# EAGLE schematic 8bit_ALU (EAGLE 9.4.1)
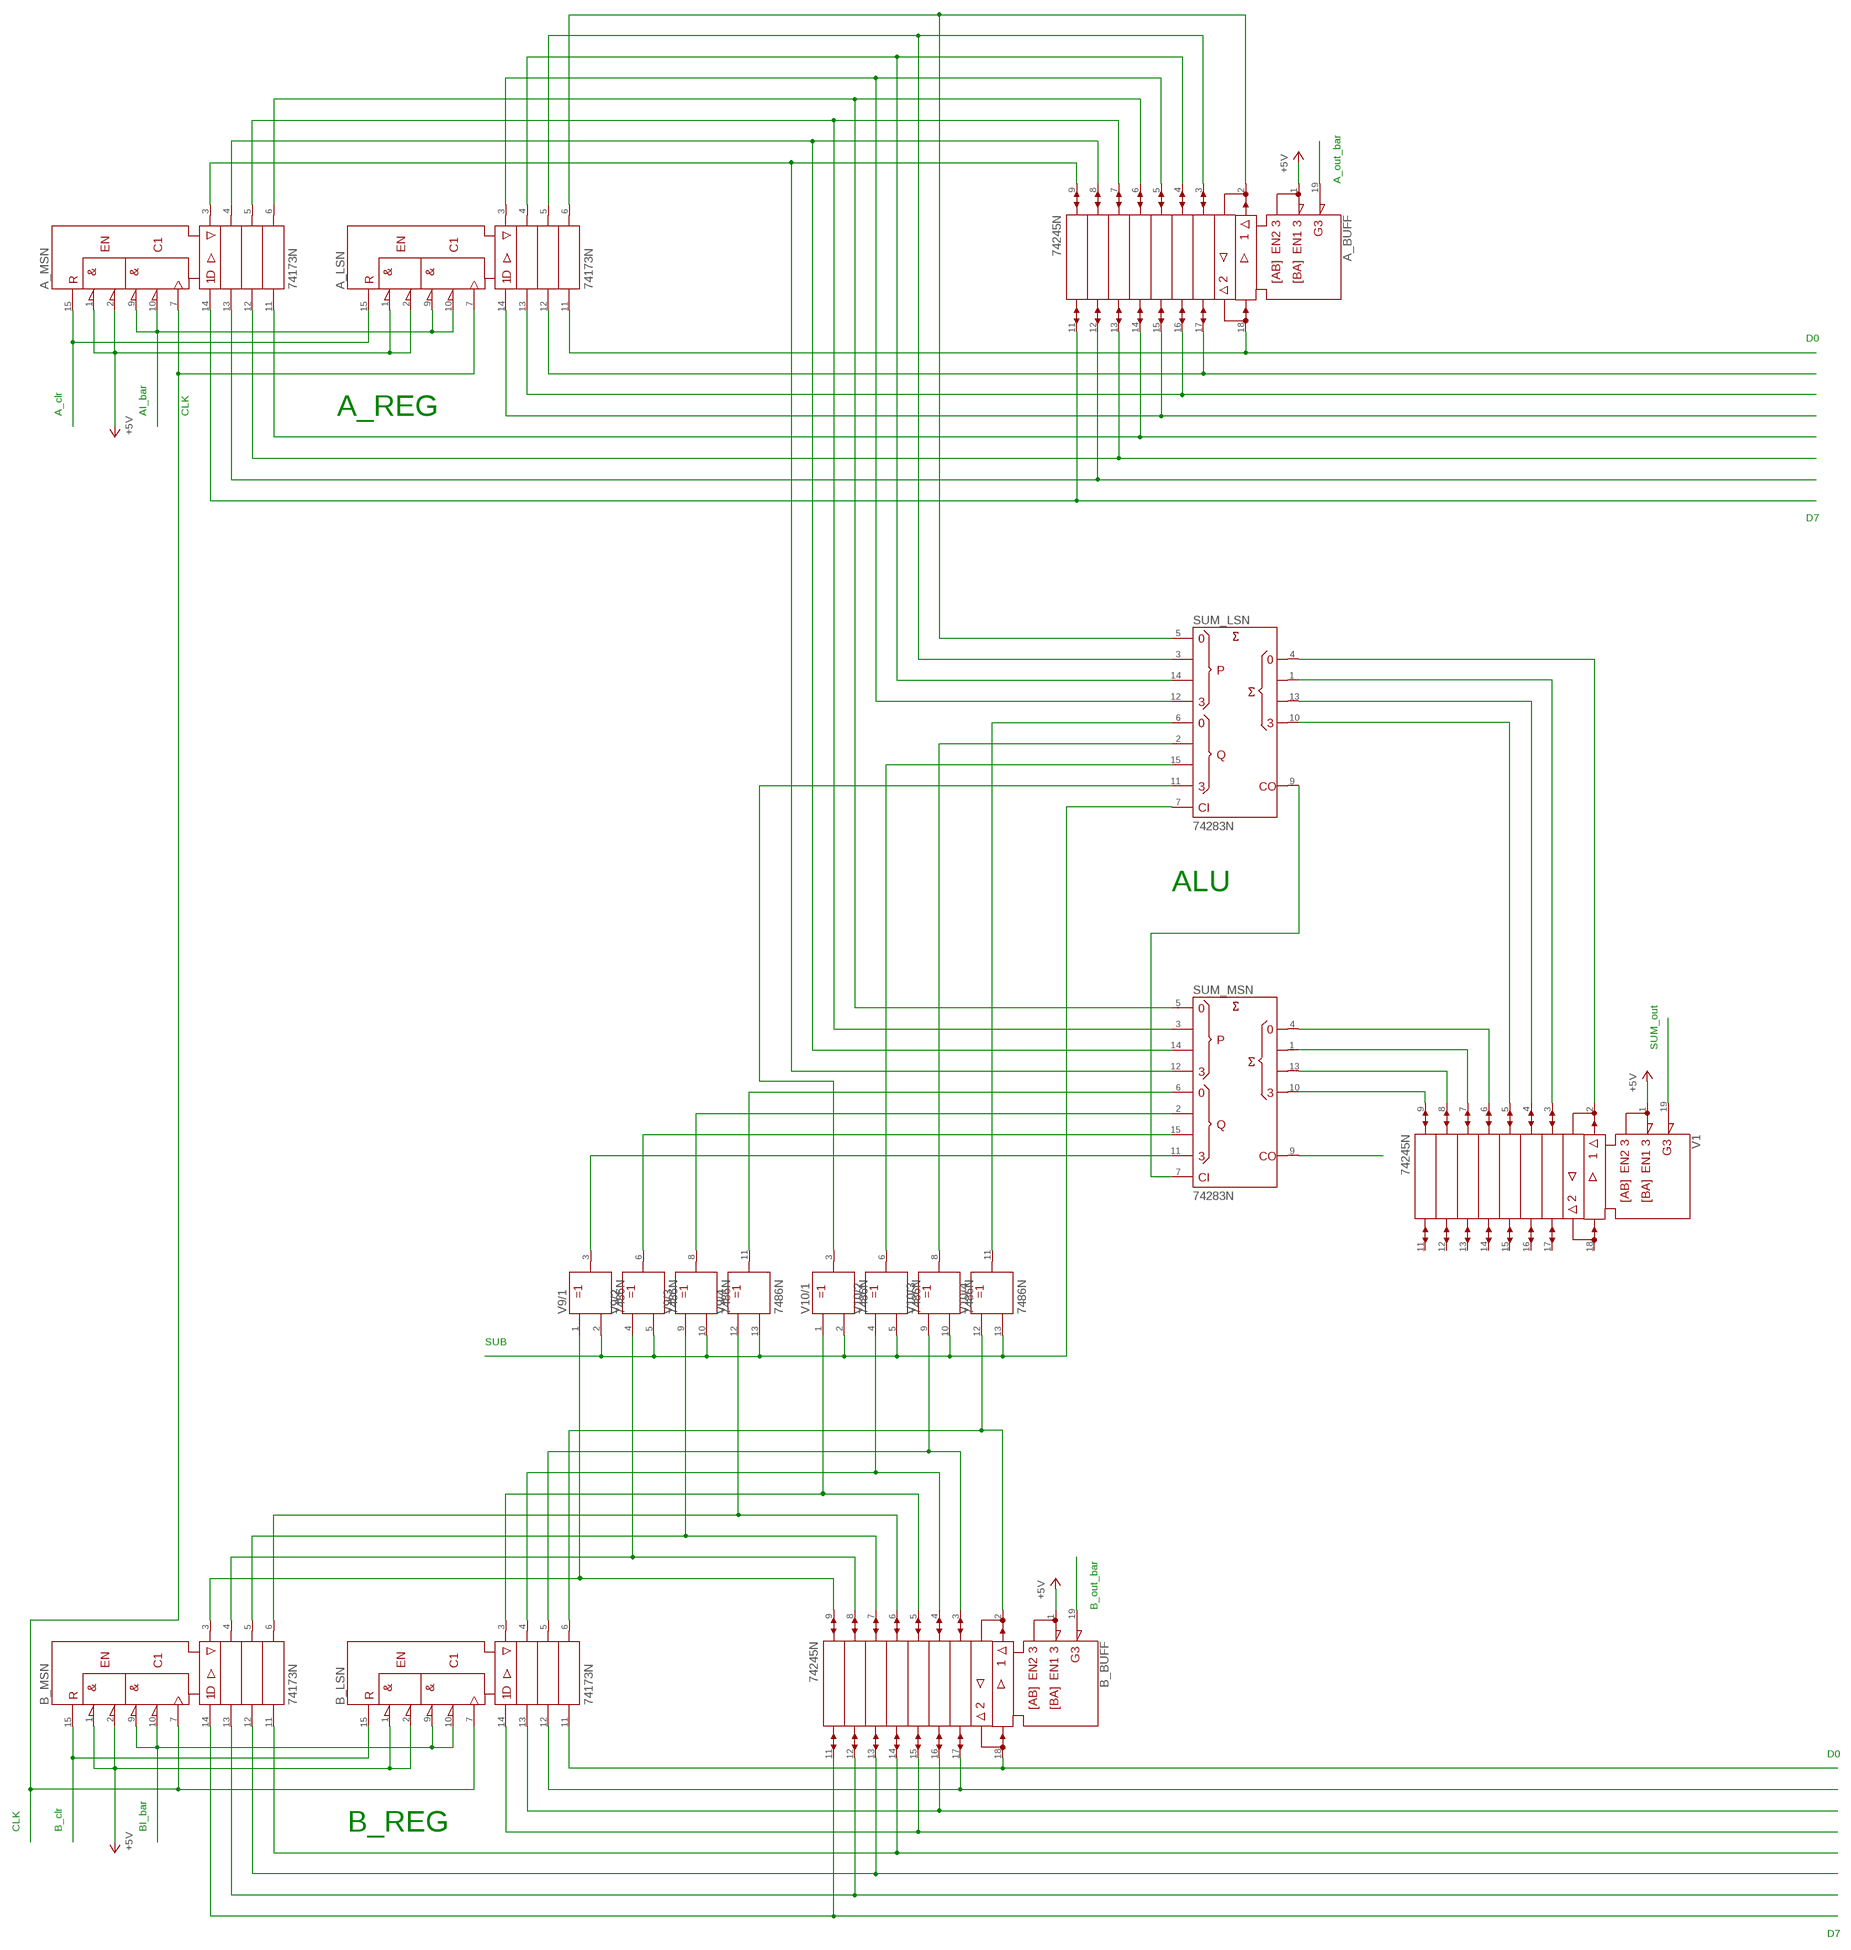
[diagram p0: schematic, sheet 1]

## Parts
A_BUFF  74245N  [DIL20]
A_LSN  74173N  [DIL16]
A_MSN  74173N  [DIL16]
B_BUFF  74245N  [DIL20]
B_LSN  74173N  [DIL16]
B_MSN  74173N  [DIL16]
SUM_LSN  74283N  [DIL16]
SUM_MSN  74283N  [DIL16]
V1  74245N  [DIL20]
V9  7486N  [DIL14]
V10  7486N  [DIL14]

## Nets
+5V: A_BUFF.1(DIR) A_LSN.1(M) A_LSN.2(N) A_MSN.1(M) A_MSN.2(N) B_BUFF.1(DIR) B_LSN.1(M) B_LSN.2(N) B_MSN.1(M) B_MSN.2(N) V1.1(DIR)
N$1: A_LSN.9(!G1) A_LSN.10(!G2) A_MSN.9(!G1) A_MSN.10(!G2)
N$2: A_LSN.15(CLR) A_MSN.15(CLR)
N$3: A_BUFF.19(!G)
N$4: B_BUFF.9(A8) B_MSN.3(1Q) V9.1(/1:A)
N$5: A_LSN.7(CLK) A_MSN.7(CLK) B_LSN.7(CLK) B_MSN.7(CLK)
N$6: B_BUFF.17(B2) B_LSN.12(3D)
N$7: B_BUFF.16(B3) B_LSN.13(2D)
N$8: B_BUFF.15(B4) B_LSN.14(1D)
N$9: B_BUFF.14(B5) B_MSN.11(4D)
N$10: B_BUFF.8(A7) B_MSN.4(2Q) V9.4(/2:A)
N$11: SUM_LSN.4(S1) V1.2(A1)
N$12: SUM_LSN.6(B1) V10.11(/4:Y)
N$13: B_BUFF.18(B1) B_LSN.11(4D)
N$14: B_BUFF.7(A6) B_MSN.5(3Q) V9.9(/3:A)
N$15: A_BUFF.17(B2) A_LSN.12(3D)
N$16: SUM_LSN.2(B2) V10.8(/3:Y)
N$17: SUM_LSN.15(B3) V10.6(/2:Y)
N$18: A_BUFF.13(B6) A_MSN.12(3D)
N$19: A_BUFF.12(B7) A_MSN.13(2D)
N$20: A_BUFF.11(B8) A_MSN.14(1D)
N$21: B_BUFF.6(A5) B_MSN.6(4Q) V9.12(/4:A)
N$22: B_LSN.9(!G1) B_LSN.10(!G2) B_MSN.9(!G1) B_MSN.10(!G2)
N$23: B_BUFF.5(A4) B_LSN.3(1Q) V10.1(/1:A)
N$24: B_LSN.15(CLR) B_MSN.15(CLR)
N$25: B_BUFF.4(A3) B_LSN.4(2Q) V10.4(/2:A)
N$26: B_BUFF.3(A2) B_LSN.5(3Q) V10.9(/3:A)
N$27: B_BUFF.2(A1) B_LSN.6(4Q) V10.12(/4:A)
N$28: A_BUFF.9(A8) A_MSN.3(1Q) SUM_MSN.12(A4)
N$29: A_BUFF.8(A7) A_MSN.4(2Q) SUM_MSN.14(A3)
N$30: A_BUFF.7(A6) A_MSN.5(3Q) SUM_MSN.3(A2)
N$31: A_BUFF.6(A5) A_MSN.6(4Q) SUM_MSN.5(A1)
N$32: A_BUFF.5(A4) A_LSN.3(1Q) SUM_LSN.12(A4)
N$33: A_BUFF.4(A3) A_LSN.4(2Q) SUM_LSN.14(A3)
N$34: A_BUFF.3(A2) A_LSN.5(3Q) SUM_LSN.3(A2)
N$35: A_BUFF.2(A1) A_LSN.6(4Q) SUM_LSN.5(A1)
N$36: A_BUFF.18(B1) A_LSN.11(4D)
N$37: SUM_LSN.11(B4) V10.3(/1:Y)
N$38: A_BUFF.16(B3) A_LSN.13(2D)
N$39: A_BUFF.15(B4) A_LSN.14(1D)
N$40: A_BUFF.14(B5) A_MSN.11(4D)
N$41: SUM_LSN.7(C0) V9.2(/1:B) V9.5(/2:B) V9.10(/3:B) V9.13(/4:B) V10.2(/1:B) V10.5(/2:B) V10.10(/3:B) V10.13(/4:B)
N$42: SUM_MSN.6(B1) V9.11(/4:Y)
N$43: SUM_MSN.2(B2) V9.8(/3:Y)
N$44: SUM_MSN.15(B3) V9.6(/2:Y)
N$45: SUM_MSN.11(B4) V9.3(/1:Y)
N$46: SUM_LSN.9(C4) SUM_MSN.7(C0)
N$47: SUM_LSN.1(S2) V1.3(A2)
N$48: SUM_LSN.13(S3) V1.4(A3)
N$49: B_BUFF.13(B6) B_MSN.12(3D)
N$50: B_BUFF.12(B7) B_MSN.13(2D)
N$51: B_BUFF.11(B8) B_MSN.14(1D)
N$52: SUM_LSN.10(S4) V1.5(A4)
N$53: SUM_MSN.4(S1) V1.6(A5)
N$54: SUM_MSN.1(S2) V1.7(A6)
N$55: SUM_MSN.13(S3) V1.8(A7)
N$56: SUM_MSN.10(S4) V1.9(A8)
N$57: V1.19(!G)
N$58: SUM_MSN.9(C4)
N$59: B_BUFF.19(!G)
Unconnected: V1.11(B8) V1.12(B7) V1.13(B6) V1.14(B5) V1.15(B4) V1.16(B3) V1.17(B2) V1.18(B1)

## Notes on the sheet
- A_out_bar
- D0
- A_clr | AI_bar | CLK | A_REG
- D7
- ALU
- SUM_out
- SUB
- B_out_bar
- D0
- CLK | B_clr | BI_bar | B_REG
- D7

## Power pins joined to a net without a drawn wire
+UB: A_BUFF.20(+UB) A_LSN.16(+UB) A_MSN.16(+UB) B_BUFF.20(+UB) B_LSN.16(+UB) B_MSN.16(+UB) SUM_LSN.16(+UB) SUM_MSN.16(+UB) V1.20(+UB) V9.14(/+UB:+UB) V10.14(/+UB:+UB)
-UB: A_BUFF.10(-UB) A_LSN.8(-UB) A_MSN.8(-UB) B_BUFF.10(-UB) B_LSN.8(-UB) B_MSN.8(-UB) SUM_LSN.8(-UB) SUM_MSN.8(-UB) V1.10(-UB) V9.7(/-UB:-UB) V10.7(/-UB:-UB)

## Library data of the parts
A_BUFF B_BUFF V1 = 74ttl-din:74*245: Octal BUS TRANSCEIVER, 3-state
A_LSN A_MSN B_LSN B_MSN = 74ttl-din:74*173: 4-bit D type REGISTER, 3-state
SUM_LSN SUM_MSN = 74ttl-din:74*283: 4-bit binary FULL ADDER, fast carry
V9 V10 = 74ttl-din:74*86: Quad 2-input EXCLUSIV-OR gate